# Altium schematic sheet Sht3-V12P0_reg.SchDoc
size C; SheetNumber: 3; SheetTotal: 4
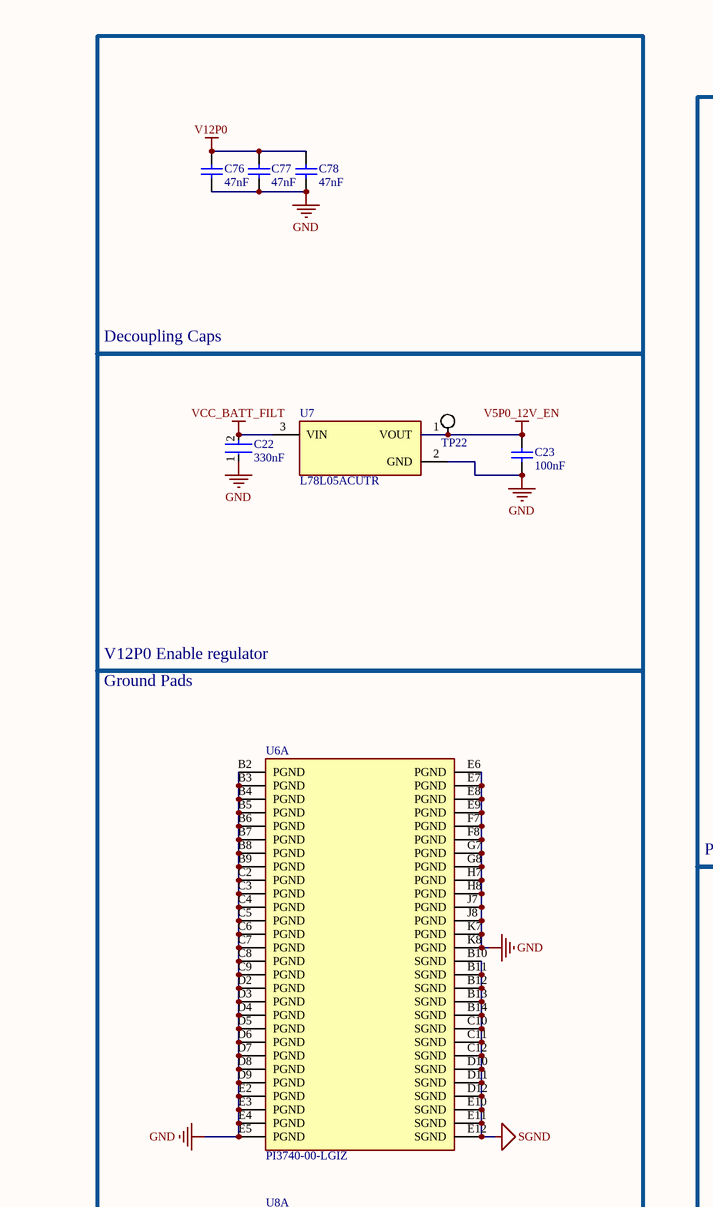
[diagram p0: Sht3-V12P0_reg.SchDoc, top left]
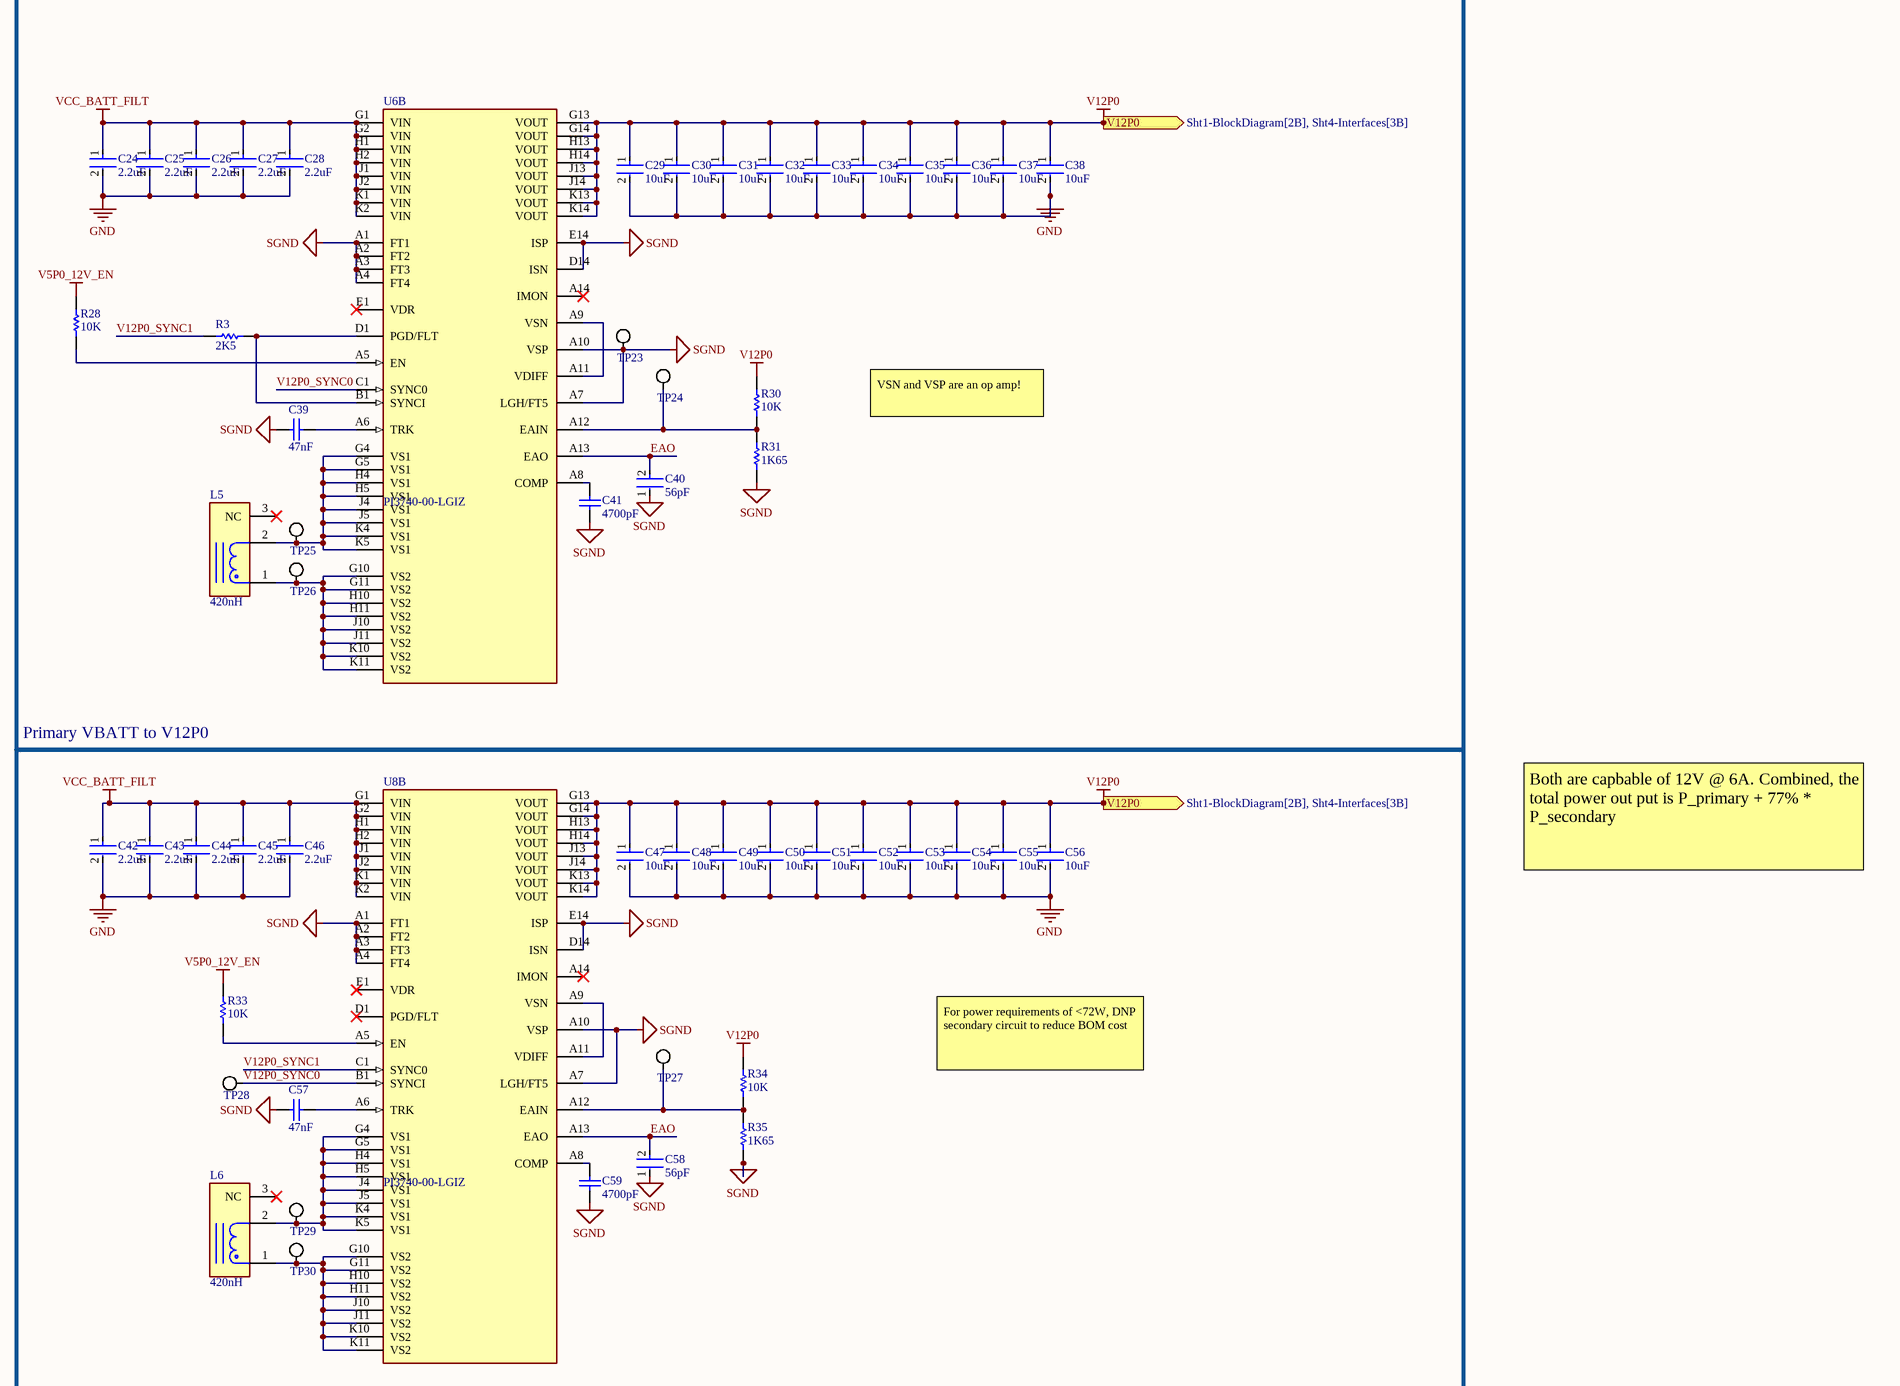
[diagram p1: Sht3-V12P0_reg.SchDoc, top right]
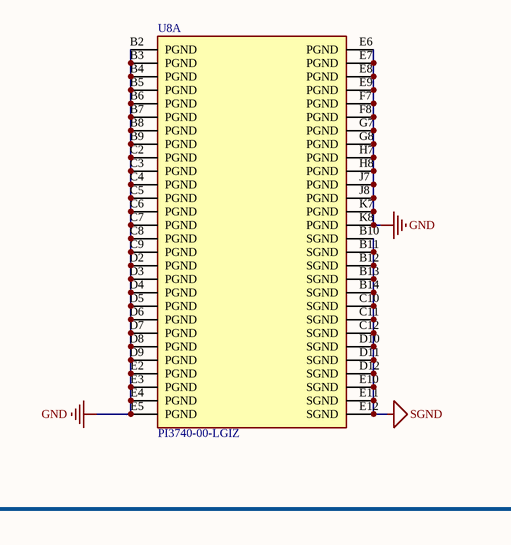
[diagram p2: Sht3-V12P0_reg.SchDoc, bottom left]
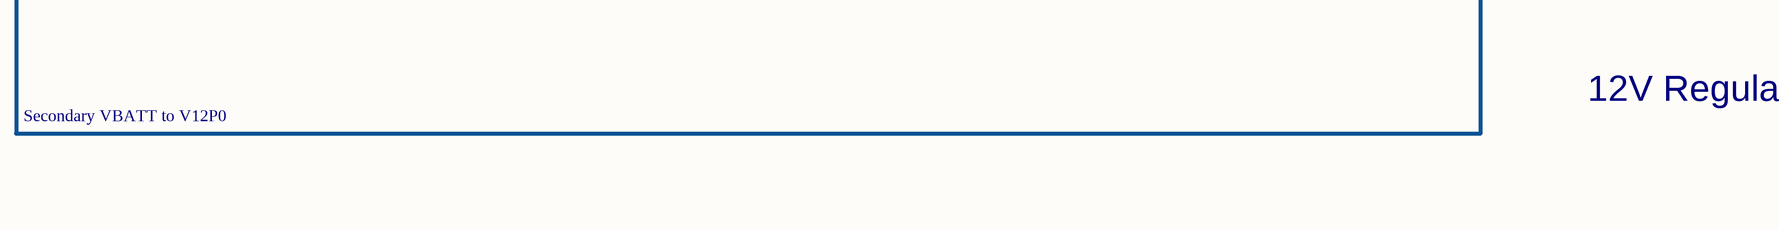
[diagram p3: Sht3-V12P0_reg.SchDoc, bottom right]

## Parts
C22  330nF  [FP-C1608-080-0_1-IPC_A]
C23  100nF  [CAPC0603(1608)100_L]
C24  2.2uF  [FP-1210-L_3_3_0_4-W_2_5_0-IPC_B]
C25  2.2uF  [FP-1210-L_3_3_0_4-W_2_5_0-IPC_B]
C26  2.2uF  [FP-1210-L_3_3_0_4-W_2_5_0-IPC_B]
C27  2.2uF  [FP-1210-L_3_3_0_4-W_2_5_0-IPC_B]
C28  2.2uF  [FP-1210-L_3_3_0_4-W_2_5_0-IPC_B]
C29  10uF  [FP-GRM32-MFG]
C30  10uF  [FP-GRM32-MFG]
C31  10uF  [FP-GRM32-MFG]
C32  10uF  [FP-GRM32-MFG]
C33  10uF  [FP-GRM32-MFG]
C34  10uF  [FP-GRM32-MFG]
C35  10uF  [FP-GRM32-MFG]
C36  10uF  [FP-GRM32-MFG]
C37  10uF  [FP-GRM32-MFG]
C38  10uF  [FP-GRM32-MFG]
C39  47nF  [CAPC1608X90X35LL10T15]
C40  56pF  [FP-C1608-080-0_1-IPC_C]
C41  4700pF  [CAPC1608X90X35ML10T15]
C42  2.2uF  [FP-1210-L_3_3_0_4-W_2_5_0-IPC_B]
C43  2.2uF  [FP-1210-L_3_3_0_4-W_2_5_0-IPC_B]
C44  2.2uF  [FP-1210-L_3_3_0_4-W_2_5_0-IPC_B]
C45  2.2uF  [FP-1210-L_3_3_0_4-W_2_5_0-IPC_B]
C46  2.2uF  [FP-1210-L_3_3_0_4-W_2_5_0-IPC_B]
C47  10uF  [FP-GRM32-MFG]
C48  10uF  [FP-GRM32-MFG]
C49  10uF  [FP-GRM32-MFG]
C50  10uF  [FP-GRM32-MFG]
C51  10uF  [FP-GRM32-MFG]
C52  10uF  [FP-GRM32-MFG]
C53  10uF  [FP-GRM32-MFG]
C54  10uF  [FP-GRM32-MFG]
C55  10uF  [FP-GRM32-MFG]
C56  10uF  [FP-GRM32-MFG]
C57  47nF  [CAPC1608X90X35LL10T15]
C58  56pF  [FP-C1608-080-0_1-IPC_C]
C59  4700pF  [CAPC1608X90X35ML10T15]
C76  47nF  [CAPC1608X90X35LL10T15]
C77  47nF  [CAPC1608X90X35LL10T15]
C78  47nF  [CAPC1608X90X35LL10T15]
L5  420nH  [FP-HCV1206-R42-R-MFG]
L6  420nH  [FP-HCV1206-R42-R-MFG]
R3  2K5  [RESC1608X55X25NL10T15]
R28  10K  [RESC1609X50X30NL8T20]
R30  10K  [RESC1609X50X30NL8T20]
R31  1K65  [RESC1608X55X25ML10T15]
R33  10K  [RESC1609X50X30NL8T20]
R34  10K  [RESC1609X50X30NL8T20]
R35  1K65  [RESC1608X55X25ML10T15]
TP22  (no value)  [Test Point Pad]
TP23  (no value)  [Test Point Pad]
TP24  (no value)  [Test Point Pad]
TP25  (no value)  [Test Point Pad]
TP26  (no value)  [Test Point Pad]
TP27  (no value)  [Test Point Pad]
TP28  (no value)  [Test Point Pad]
TP29  (no value)  [Test Point Pad]
TP30  (no value)  [Test Point Pad]
U6  PI3740-00-LGIZ  [FP-PI3740-00-LGIZ-MFG]  (parts A,B of 2)
U7  L78L05ACUTR  [FP-SOT-89-7098166-MFG]
U8  PI3740-00-LGIZ  [FP-PI3740-00-LGIZ-MFG]  (parts A,B of 2)

## Blocks framed on the sheet
Decoupling Caps: C76-C78
Primary VBATT to V12P0: C24-C41 L5 R3 R28 R30 R31 TP23-TP26 U6
Secondary VBATT to V12P0: C42-C59 L6 R33-R35 TP27-TP30 U8

## Ports
V12P0 (out, see Sht1-BlockDiagram[2B], Sht4-Interfaces[3B])

## Nets
GND: C22.1 C23.2 C24.2 C25.2 C26.2 C27.2 C28.2 C29.2 C30.2 C31.2 C32.2 C33.2 C34.2 C35.2 C36.2 C37.2 C38.2 C42.2 C43.2 C44.2 C45.2 C46.2 C47.2 C48.2 C49.2 C50.2 C51.2 C52.2 C53.2 C54.2 C55.2 C56.2 C76.2 C77.2 C78.2 U6.B2(PGND) U6.B3(PGND) U6.B4(PGND) U6.B5(PGND) U6.B6(PGND) U6.B7(PGND) U6.B8(PGND) U6.B9(PGND) U6.C2(PGND) U6.C3(PGND) U6.C4(PGND) U6.C5(PGND) U6.C6(PGND) U6.C7(PGND) U6.C8(PGND) U6.C9(PGND) U6.D2(PGND) U6.D3(PGND) U6.D4(PGND) U6.D5(PGND) U6.D6(PGND) U6.D7(PGND) U6.D8(PGND) U6.D9(PGND) U6.E2(PGND) U6.E3(PGND) U6.E4(PGND) U6.E5(PGND) U6.E6(PGND) U6.E7(PGND) U6.E8(PGND) U6.E9(PGND) U6.F7(PGND) U6.F8(PGND) U6.G7(PGND) U6.G8(PGND) U6.H7(PGND) U6.H8(PGND) U6.J7(PGND) U6.J8(PGND) U6.K7(PGND) U6.K8(PGND) U7.2(GND) U8.B2(PGND) U8.B3(PGND) U8.B4(PGND) U8.B5(PGND) U8.B6(PGND) U8.B7(PGND) U8.B8(PGND) U8.B9(PGND) U8.C2(PGND) U8.C3(PGND) U8.C4(PGND) U8.C5(PGND) U8.C6(PGND) U8.C7(PGND) U8.C8(PGND) U8.C9(PGND) U8.D2(PGND) U8.D3(PGND) U8.D4(PGND) U8.D5(PGND) U8.D6(PGND) U8.D7(PGND) U8.D8(PGND) U8.D9(PGND) U8.E2(PGND) U8.E3(PGND) U8.E4(PGND) U8.E5(PGND) U8.E6(PGND) U8.E7(PGND) U8.E8(PGND) U8.E9(PGND) U8.F7(PGND) U8.F8(PGND) U8.G7(PGND) U8.G8(PGND) U8.H7(PGND) U8.H8(PGND) U8.J7(PGND) U8.J8(PGND) U8.K7(PGND) U8.K8(PGND)
SGND: C39.2 C40.1 C41.2 C57.1 C58.1 C59.2 R31.1 R35.1 TP23.1 U6.A1(FT1) U6.A2(FT2) U6.A3(FT3) U6.A4(FT4) U6.A7(LGH/FT5) U6.A10(VSP) U6.B10(SGND) U6.B11(SGND) U6.B12(SGND) U6.B13(SGND) U6.B14(SGND) U6.C10(SGND) U6.C11(SGND) U6.C12(SGND) U6.D10(SGND) U6.D11(SGND) U6.D12(SGND) U6.D14(ISN) U6.E10(SGND) U6.E11(SGND) U6.E12(SGND) U6.E14(ISP) U8.A1(FT1) U8.A2(FT2) U8.A3(FT3) U8.A4(FT4) U8.A7(LGH/FT5) U8.A10(VSP) U8.B10(SGND) U8.B11(SGND) U8.B12(SGND) U8.B13(SGND) U8.B14(SGND) U8.C10(SGND) U8.C11(SGND) U8.C12(SGND) U8.D10(SGND) U8.D11(SGND) U8.D12(SGND) U8.D14(ISN) U8.E10(SGND) U8.E11(SGND) U8.E12(SGND) U8.E14(ISP)
V5P0_12V_EN: C23.1 R28.2 R33.2 TP22.1 U7.1(VOUT)
V12P0: C29.1 C30.1 C31.1 C32.1 C33.1 C34.1 C35.1 C36.1 C37.1 C38.1 C47.1 C48.1 C49.1 C50.1 C51.1 C52.1 C53.1 C54.1 C55.1 C56.1 C76.1 C77.1 C78.1 R30.2 R34.2 U6.G13(VOUT) U6.G14(VOUT) U6.H13(VOUT) U6.H14(VOUT) U6.J13(VOUT) U6.J14(VOUT) U6.K13(VOUT) U6.K14(VOUT) U8.G13(VOUT) U8.G14(VOUT) U8.H13(VOUT) U8.H14(VOUT) U8.J13(VOUT) U8.J14(VOUT) U8.K13(VOUT) U8.K14(VOUT) ; port V12P0
VCC_BATT_FILT: C22.2 C24.1 C25.1 C26.1 C27.1 C28.1 C42.1 C43.1 C44.1 C45.1 C46.1 U6.G1(VIN) U6.G2(VIN) U6.H1(VIN) U6.H2(VIN) U6.J1(VIN) U6.J2(VIN) U6.K1(VIN) U6.K2(VIN) U7.3(VIN) U8.G1(VIN) U8.G2(VIN) U8.H1(VIN) U8.H2(VIN) U8.J1(VIN) U8.J2(VIN) U8.K1(VIN) U8.K2(VIN)
EAO: C40.2 C58.2 U6.A13(EAO) U8.A13(EAO)
V12P0_SYNC0: TP28.1 U6.C1(SYNC0) U8.B1(SYNCI)
V12P0_SYNC1: R3.1 U8.C1(SYNC0)
NetC39_1: C39.1 U6.A6(TRK)
NetC41_1: C41.1 U6.A8(COMP)
NetC57_2: C57.2 U8.A6(TRK)
NetC59_1: C59.1 U8.A8(COMP)
NetL5_1: L5.1 TP26.1 U6.G10(VS2) U6.G11(VS2) U6.H10(VS2) U6.H11(VS2) U6.J10(VS2) U6.J11(VS2) U6.K10(VS2) U6.K11(VS2)
NetL5_2: L5.2 TP25.1 U6.G4(VS1) U6.G5(VS1) U6.H4(VS1) U6.H5(VS1) U6.J4(VS1) U6.J5(VS1) U6.K4(VS1) U6.K5(VS1)
NetL6_1: L6.1 TP30.1 U8.G10(VS2) U8.G11(VS2) U8.H10(VS2) U8.H11(VS2) U8.J10(VS2) U8.J11(VS2) U8.K10(VS2) U8.K11(VS2)
NetL6_2: L6.2 TP29.1 U8.G4(VS1) U8.G5(VS1) U8.H4(VS1) U8.H5(VS1) U8.J4(VS1) U8.J5(VS1) U8.K4(VS1) U8.K5(VS1)
NetR3_2: R3.2 U6.B1(SYNCI) U6.D1(PGD/FLT)
NetR28_1: R28.1 U6.A5(EN)
NetR30_1: R30.1 R31.2 TP24.1 U6.A12(EAIN)
NetR33_1: R33.1 U8.A5(EN)
NetR34_1: R34.1 R35.2 TP27.1 U8.A12(EAIN)
NetU6_A9: U6.A9(VSN) U6.A11(VDIFF)
NetU8_A9: U8.A9(VSN) U8.A11(VDIFF)

Not connected (* = marked no-connect by the designer): L5 3(NC)*; L6 3(NC)*; U6 A14(IMON)* E1(VDR)*; U8 A14(IMON)* D1(PGD/FLT)* E1(VDR)*

## Notes on the sheet
- VSN and VSP are an op amp!
- V12P0 Enable regulator
- Ground Pads
- Both are capbable of 12V @ 6A. Combined, the total power out put is P_primary + 77% * P_secondary
- For power requirements of <72W, DNP secondary circuit to reduce BOM cost
- 12V Regulators

## Library data of the parts
C22 = 330nF 0603: Multilayer Ceramic Capacitors 330nF ±10% 50V X7R SMD 0603; Capacitance: 330nF; Case Code (Imperial): 0603; Case Code (Metric): 1608; Dielectric: X7R; Length: 1.6mm; Construction: Flat; Resistor Type: Ceramic; Mount: Surface Mount; Voltage Rating: 50V; Packaging: Tape and Reel; Series: C; Case/Package: 0603; Lead Free: Lead Free; Tolerance: 10%; Voltage: 50V; REACH SVHC: No SVHC; Height: 0.8mm; Weight: 7.1E-05oz; Termination: SMD/SMT; Max Operating Temperature: 125°C; RoHS Compliant: Yes; Min Operating Temperature: -55°C; Depth: 0.8mm; Package Quantity: 1; Thickness: 0.037inch; Voltage Rating (DC): 50V; Dielectric Material: Ceramic; Width: 0.031inch; ComponentLink1Description: Link; ComponentLink1URL: https://www.digikey.com/en/products/detail/tdk-corporation/C1608X7R1H334K080AC/2443428
C23 = 100nF 0603: CAP 100nF 100V ±10% 0603 (1608 Metric) Thickness 1mm SMD; Tolerance: Â±10%; Case-EIA: 0603; Case-Metric: 1608; Rated Voltage: 100 V; Value: 100nF; Technology: SMT; Max Thickness: 1 mm; ComponentLink1Description: Link; ComponentLink1URL: https://www.digikey.com/en/products/detail/samsung-electro-mechanics/CL10B104KC8NNNC/5961291
C24-C28 C42-C46 = 2.2uF 1210: General Purpose Ceramic Capacitor, 1210, 2.2uF, 10%, X7R, 15%, 100V; Dissipation Factor: 2.5%; Number of Pins: 2; Lead Free: Lead Free; Voltage Rating: 100V; Min Operating Temperature: -55°C; Height: 2.79mm; Length: 3.2mm; Capacitance: 2.2uF; RoHS Compliant: Yes; Case/Package: 1210; Max Operating Temperature: 125°C; Radiation Hardening: No; Series: -; Case Code (Metric): 3225; Dielectric: X7R; Voltage Rating (DC): 100V; Packaging: Tape and Reel; Width: 2.5mm; Thickness: 0.11inch; Depth: 2.5mm; Contact Plating: Tin; REACH SVHC: No SVHC; Tolerance: 10%; Construction: Flat; Case Code (Imperial): 1210; Mount: Surface Mount; Package Quantity: 1; Termination: SMD/SMT; Voltage: 100V; ComponentLink1Description: Link; ComponentLink1URL: https://www.digikey.com/en/products/detail/samsung-electro-mechanics/CL32B225KCJSNNE/3889020
C29-C38 C47-C56 = 10uF 1210: CAP CER 10UF 50V X7R 1210; Manufacturer Part Number: GRM32ER71H106KA12L; Manufacturer: Murata; Tolerance: 10%; Material: Ceramic; Temperature Coefficient: 15%; Voltage Rating: 50V; Temperature Characteristic: X7R; Value: 10uF; ComponentLink2Description: Datasheet; Device Class L1: Passive Components; Lead Free: Yes; Temperature Range High: +125°C; Category: Cap; ComponentLink2URL: https://search.murata.co.jp/Ceramy/image/img/A01X/G101/ENG/GRM32ER71H106KA12-01.pdf; Device Class L2: Capacitors; Package: GRM32; Mouser Description: 1210 10 uF 50 V ±10% Tolerance X7R SMT Multilayer Ceramic Capacitor; Capacitance: 10uF; Octopart: https://octopart.com/grm32er71h106ka12l-murata-10470987; Digikey Description: CAP CER 10UF 50V X7R 1210; Height: 2.7mm; Temperature: -55°C to +125°C; Temperature Range Low: -55°C; RoHS: TRUE; Device Class L3: Ceramic Capacitors; Automotive: No; ComponentLink3Description: Link; ComponentLink3URL: https://www.digikey.com/en/products/detail/samsung-electro-mechanics/CL32B106KBJNNNE/3889045
C39 C57 C76-C78 = 47nF 0603: Manufacturer: Murata; Part Number: GRM188R71E473KA01D; ComponentLink1Description: Link; ComponentLink1URL: https://www.digikey.com/en/products/detail/kemet/C0603X473J4RECAUTO7411/8654446
C40 C58 = 56pF 0603: Multilayer Ceramic Capacitors 56pF ±5% 50V C0G SMD 0603; Voltage Rating (DC): 50V; Lead Free: Lead Free; Termination: SMD/SMT; Min Operating Temperature: -55°C; Dielectric: C0G; Dielectric Material: Ceramic; Packaging: Tape and Reel; REACH SVHC: No SVHC; Case Code (Imperial): 0603; Package Quantity: 1; Case/Package: 0603; Tolerance: 5%; Mount: Surface Mount; Depth: 0.8mm; Series: C; Construction: Flat; Max Operating Temperature: 125°C; RoHS Compliant: Yes; Thickness: 0.037inch; Radiation Hardening: No; Width: 0.031inch; Height: 0.8mm; Capacitance: 56pF; Voltage Rating: 50V; Weight: 7.1E-05oz; Case Code (Metric): 1608; Length: 1.6mm; ComponentLink1Description: Link; ComponentLink1URL: https://www.digikey.com/en/products/detail/samsung-electro-mechanics/CL10C560JB8NNNC/3886855
C41 C59 = 4700pF 0603: Part Number: GRM188R72A472KA01D; Manufacturer: Murata; ComponentLink1Description: Link; ComponentLink1URL: https://www.digikey.com/en/products/detail/walsin-technology-corporation/0603B472J500CT/9354937
L5 L6 = HCV1206-R42-R: HCV1206-R42-R -FIXED IND 420NH 16A 3.15 MOHM; Shielding: Unshielded; Tolerance: 10%; DC Resistance (DCR): 3.15mR; Core Material: Ferrite; Saturation Current: 42A; Test Frequency: 100kHz; Mount: Surface Mount; Length: 0.48inch; Width: 0.386inch; Resistor Type: Wirewound; RoHS Compliant: Yes; Packaging: Tape and Reel; Min Operating Temperature: -55°C; Case/Package: Nonstandard; Height - Seated (Max): 0.201inch; Max Operating Temperature: 125°C; Current Rating: 16A; Lead Free: Lead Free; Inductance: 420nH; ComponentLink1Description: Link; ComponentLink1URL: https://www.digikey.com/en/products/detail/eaton-electronics-division/HCV1206-R42-R/5418747
R3 = 2K5 0603: 2.5K 0603; Manufacturer: Yageo; Part Number: RC0603FR-072K55L; ComponentLink1Description: Link; ComponentLink1URL: https://www.digikey.com/en/products/detail/yageo/RC0603FR-072K55L/727029
R28 R30 R33 R34 = 10K 0603: Chip Resistor, 10 KOhm, +/- 1%, 100 mW, -55 to 155 degC, 0603 (1608 Metric), RoHS, Tape and Reel; Manufacturer: Vishay Semiconductor; Voltage Rating: 75 V; Max Operating Temperature: 155 degC; PackageDescription: 2-Pin Surface Mount Device, Body 1.575 x 0.85 mm; ComponentLink1Description: Manufacturer URL; RoHSCompliant: true; PackageReference: 0603; REACH SVHC: Unknown; Length: 1.55 mm; DatasheetVersion: 06/2012; Packaging: Tape and Reel; Min Operating Temperature: -55 degC; Mounting Technology: Surface Mount; ComponentLink2URL: https://datasheet.ciiva.com/11809/0900766b80d98afc-11809037.pdf; Height: 0.45 mm; ComponentLink2Description: Datasheet; Package Quantity: 5000; ComponentLink1URL: http://www.vishay.com/; ComponentLink3Description: Link; ComponentLink3URL: https://www.digikey.com/en/products/detail/stackpole-electronics-inc/RNCP0603FTD10K0/2240139
R31 R35 = 1K65 0603: 1.65k 0603; Part Number: RC0603FR-071K65L; Manufacturer: Yageo; ComponentLink1Description: Link; ComponentLink1URL: https://www.digikey.com/en/products/detail/yageo/RC0603FR-071K65L/726870
TP22-TP30 = Test Point Pad: Test point, Pad, 28 mil
U6 U8 = PI3740-00-LGIZ: DC DC CONVERTER 10-50V; Max Output Current: 6.5A; Max Input Voltage: 60V; Voltage - Output 1: 50V; Min Input Voltage: 8V; Efficiency: 96%; Number of Outputs: 1; Max Operating Temperature: 115°C; Features: UVLO; Series: Cool-Power® (140W); RoHS Compliant: Yes; Min Operating Temperature: -40°C; Mount: Surface Mount; Case/Package: LGA; Packaging: Tray; ComponentLink1Description: Link; ComponentLink1URL: https://www.digikey.com/en/products/detail/vicor-corporation/PI3740-00-LGIZ/6573281
U7 = L78L05ACUTR: IC REG LINEAR 5V 100MA SOT89-3; Output Voltage Accuracy: 4%; Number of Regulators: 1; Polarity: Positive; Quiescent Current: 6mA; Min Input Voltage: 7V; Power Supply Rejection Ratio (PSRR): 49dB; Output Type: Fixed; Max Input Voltage: 30V; Dropout Voltage: 1.7V; Nominal Output Voltage: 5V; Radiation Hardening: No; Number of Pins: 3; Weight: 0.004603oz; Output Current: 100mA; Width: 2.6mm; Packaging: Tape and Reel; Output Voltage: 5V; Length: 4.6mm; Max Output Current: 100mA; Min Operating Temperature: 0°C; Package Quantity: 1; Accuracy: 4%; Case/Package: SOT-89; Lead Free: Lead Free; Height: 1.6mm; Min Output Voltage: 5V; Contact Plating: Tin; Number of Outputs: 1; REACH SVHC: No SVHC; Mount: Surface Mount; Max Operating Temperature: 125°C; ComponentLink1Description: Link; ComponentLink1URL: https://www.digikey.com/en/products/detail/stmicroelectronics/L78L05ACUTR/585707?s=N4IgTCBcDaIDIHYAccAMBWAggYQKoBUAlEAXQF8g